# EAGLE design PCB (EAGLE 7.7.0)
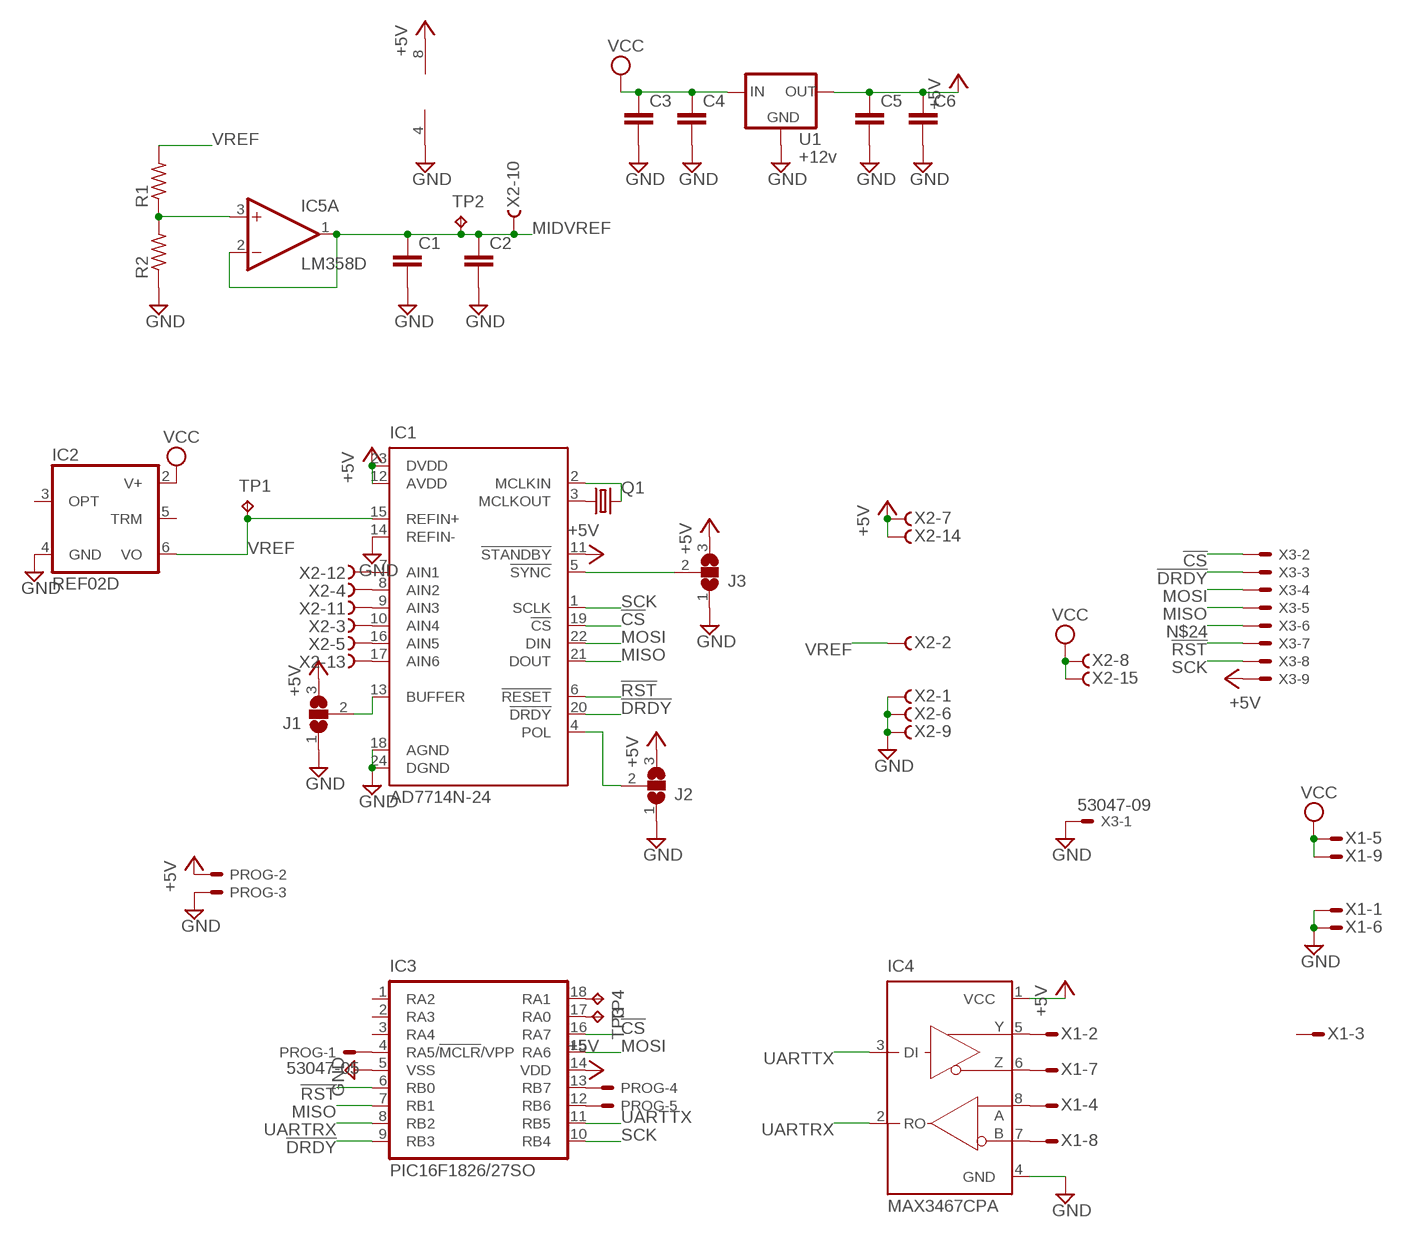
[diagram p0: schematic, sheet 1]

## Parts
C1  C-EUC1206K  [C1206K]
C2  C-EUC1206K  [C1206K]
C3  C-EUC1206K  [C1206K]
C4  C-EUC1206K  [C1206K]
C5  C-EUC1206K  [C1206K]
C6  C-EUC1206K  [C1206K]
IC1  AD7714N-24  [DIL24-3]
IC2  REF02D  [SO08]
IC3  PIC16F1826/27SO  [SO-18W]
IC4  MAX3467CPA  [SO08]
IC5  LM358D  [SO08]
J1  SJ2W  [SJ_2]
J2  SJ2W  [SJ_2]
J3  SJ2W  [SJ_2]
PROG  53047-05  [53047-05]
Q1  CRYSTALHC49S  [HC49/S]
R1  R-US_M1206  [M1206]
R2  R-US_M1206  [M1206]
TP1  TPB1,27  [B1,27]
TP2  TPB1,27  [B1,27]
TP3  TPB1,27  [B1,27]
TP4  TPB1,27  [B1,27]
U1  +12v  V_REG_78XX7812  [TO-252]
X1  M09HPS  [M09HP]
X2  F15HPS  [F15HP]
X3  53047-09  [53047-09]

## Nets
!CS: IC1.19(!CS) IC3.16(RA7) X3.2
!DRDY: IC1.20(!DRDY) IC3.9(RB3) X3.3
!RST: IC1.6(!RESET) IC3.6(RB0) X3.7
+5V: C5.1 C6.1 IC1.11(!STANDBY) IC1.12(AVDD) IC1.23(DVDD) IC3.14(VDD) IC4.1(VCC) IC5.8(P:V+) J1.3 J2.3 J3.3 PROG.2 U1.2(OUT) X2.7 X2.14 X3.9
GND: C1.2 C2.2 C3.2 C4.2 C5.2 C6.2 IC1.14(REFIN-) IC1.18(AGND) IC1.24(DGND) IC2.4(GND) IC3.5(VSS) IC4.4(GND) IC5.4(P:V-) J1.1 J2.1 J3.1 PROG.3 R2.1 U1.3(GND) X1.1 X1.6 X2.1 X2.6 X2.9 X3.1
MIDVREF: C1.1 C2.1 IC5.1(A:OUT) IC5.2(A:-IN) TP2.TP X2.10
MISO: IC1.21(DOUT) IC3.7(RB1) X3.5
MOSI: IC1.22(DIN) IC3.15(RA6) X3.4
N$1: IC1.3(MCLKOUT) Q1.1
N$2: IC1.2(MCLKIN) Q1.2
N$3: IC1.13(BUFFER) J1.2
N$4: IC1.4(POL) J2.2
N$5: IC4.5(Y) X1.2
N$6: IC4.6(Z) X1.7
N$7: IC4.8(A) X1.4
N$8: IC4.7(B) X1.8
N$9: IC5.3(A:+IN) R1.1 R2.2
N$10: IC1.10(AIN4) X2.3
N$11: IC1.9(AIN3) X2.11
N$12: IC1.8(AIN2) X2.4
N$13: IC1.7(AIN1) X2.12
N$14: IC1.5(!SYNC) J3.2
N$15: IC1.16(AIN5) X2.5
N$16: IC1.17(AIN6) X2.13
N$17: IC3.4(RA5/!MCLR!/VPP) PROG.1
N$18: IC3.13(RB7) PROG.4
N$19: IC3.12(RB6) PROG.5
N$20: IC3.17(RA0) TP3.TP
N$21: IC3.18(RA1) TP4.TP
N$24: X3.6
SCK: IC1.1(SCLK) IC3.10(RB4) X3.8
UARTRX: IC3.8(RB2) IC4.2(RO)
UARTTX: IC3.11(RB5) IC4.3(DI)
VCC: C3.1 C4.1 IC2.2(V+) U1.1(IN) X1.5 X1.9 X2.8 X2.15
VREF: IC1.15(REFIN+) IC2.6(VO) R1.2 TP1.TP X2.2
Unconnected: IC2.3(OPT) IC2.5(TRM) IC3.1(RA2) IC3.2(RA3) IC3.3(RA4) IC5.5(B:+IN) IC5.6(B:-IN) IC5.7(B:OUT) X1.3

## Library data of the parts
C1-C6 = resistor:C-EU: CAPACITOR, European symbol
IC1 = analog-devices:AD7714: Signal Conditioning ADC 3 V/5 V, CMOS, 500 mA Source: http://www.analog.com/UploadedFiles/Data_Sheets/39677768AD7714_c.pdf; MF: ALTERA CORPORATION; MPN: AD7714AN-5; OC_FARNELL: unknown; OC_NEWARK: 66F5871
IC2 = linear:REF02: VOLTAGE REFERENCE
IC3 = microchip:PIC16*F1826/27: 18/20/28-Pin Flash Microcontrollers with nanoWatt XLP Technology Source: www.microchip.com PIC16F1827.pdf
IC4 = maxim:MAX3467*: +5V, Fail-Safe, 40Mbps, Profibus RS-485/RS-422 Transceivers Source: MAX3465-MAX3469.pdf; OC_FARNELL: unknown; OC_NEWARK: unknown
IC5 = linear:LM358: OP AMP also LM158; LM258; LM2904 Source: http://cache.national.com/ds/LM/LM158.pdf
J1-J3 = jumper:SJ2W: SMD solder JUMPER
PROG = con-molex:53?-05: CONNECTOR wire to board 1.25 mm (.049 inch) pitch header; MF: MOLEX; MPN: 53047-0510; OC_FARNELL: 9732861; OC_NEWARK: 38C9901
Q1 = crystal:CRYSTAL: CRYSTAL; OC_FARNELL: 1667008; OC_NEWARK: unknown
R1 R2 = resistor:R-US_: RESISTOR, American symbol
TP1-TP4 = testpad:TP: Test pad
U1 = SparkFun-IC-Power:V_REG_78XX: Voltage Regulator Standard 78xx regulator. IGO (Input Ground Output). Spark Fun Electronics SKU : COM-00107; PROD_ID: VREG-12370
X1 = con-subd:M09?S: SUB-D; OC_FARNELL: unknown; OC_NEWARK: unknown
X2 = con-subd:F15?S: SUB-D; OC_FARNELL: unknown; OC_NEWARK: unknown
X3 = con-molex:53?-09: CONNECTOR wire to board 1.25 mm (.049 inch) pitch header; MPN: 53047-0910; OC_FARNELL: 9732888; OC_NEWARK: 98K9827

## Board
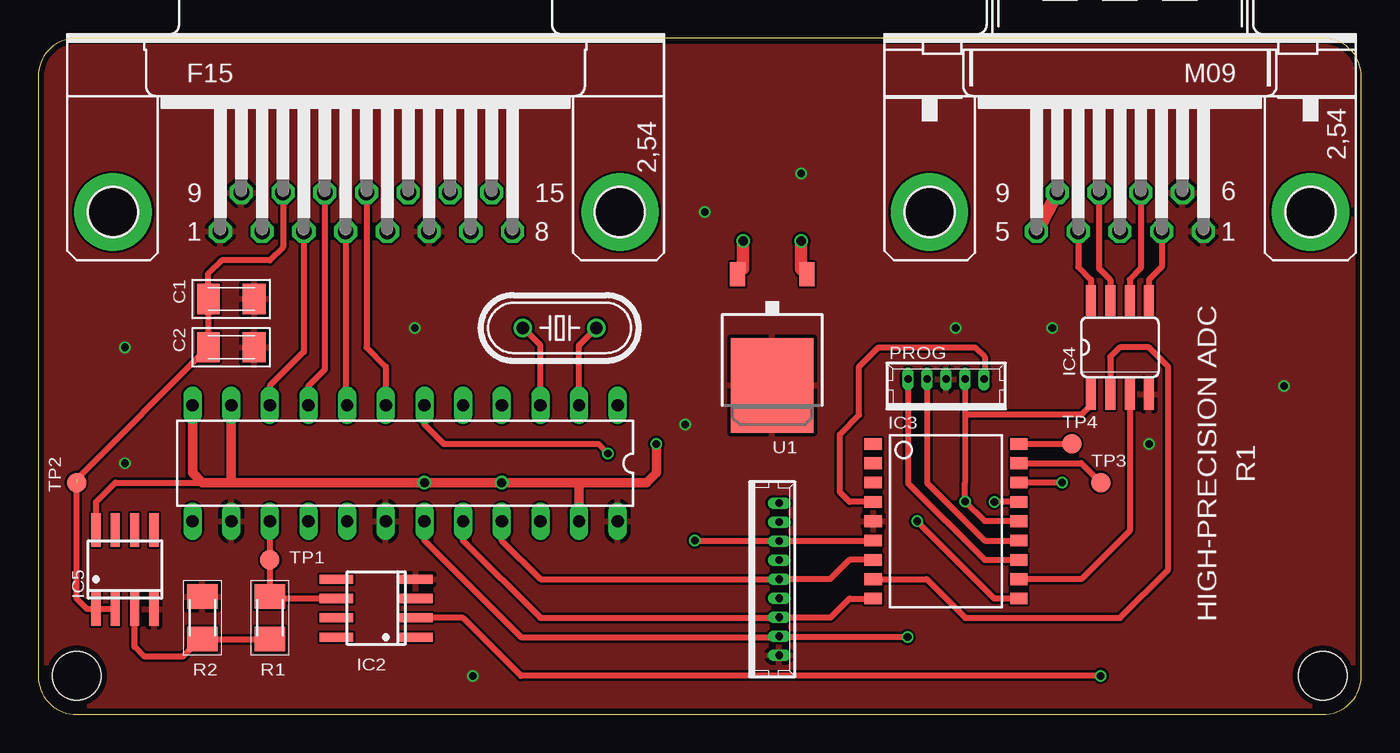
[diagram p1: board, top side]
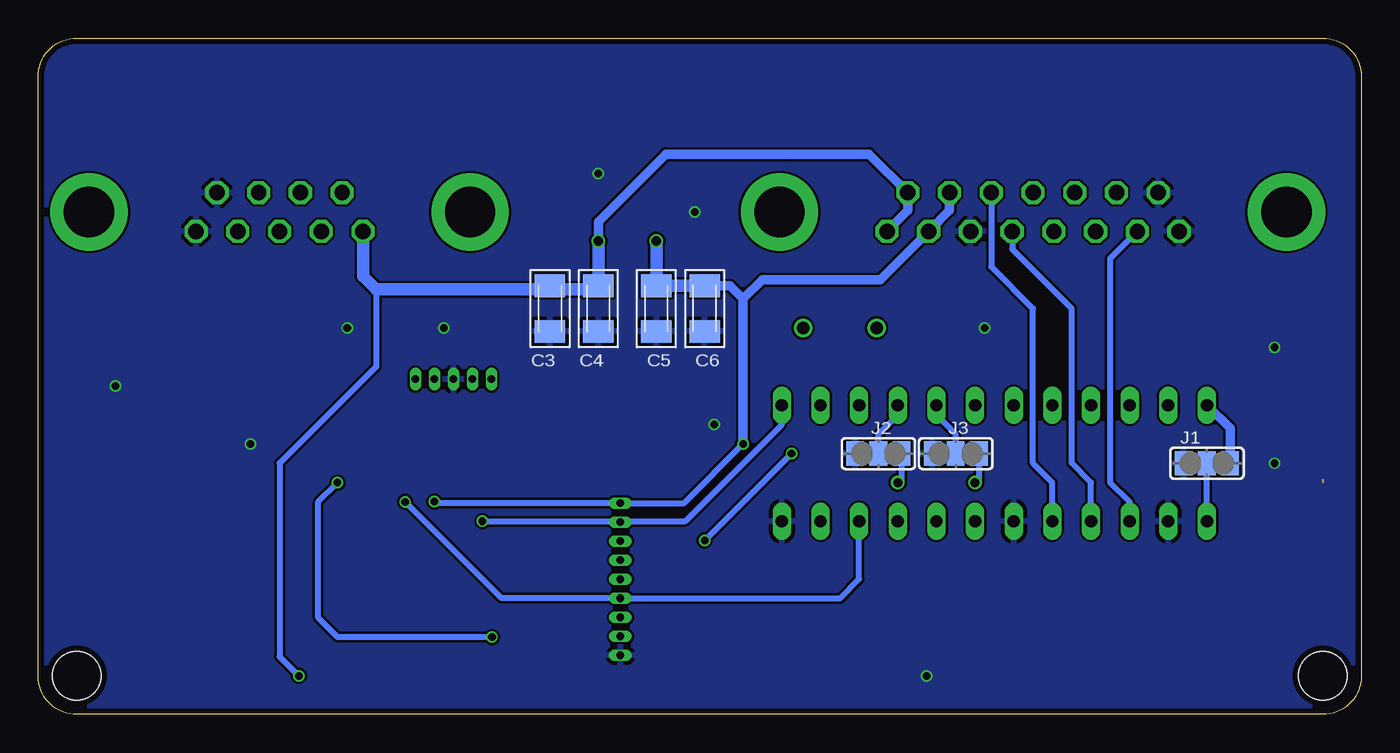
[diagram p2: board, bottom side, seen from below]

Size 87 x 44.45 mm. Coordinates in mm from the lower left corner, seen from the top.
Outline: 84.45,44.45 2.54,44.45 arc90 0,41.91 0,2.54 arc90 2.54,0 84.45,0 arc90 87,2.54 87,41.91 arc90 84.45,44.45
Copper layers (1*16): Top 0.035559375mm / dielectric 1.6mm / Bottom 0.035559375mm
Design rules "oshpark-2layer": minimum track width 6mil, minimum drill 10mil, track to track 6mil, track to pad 6mil, pad to pad 6mil, via to via 6mil, smd to smd 6mil, copper to edge 15mil, drill to drill 6mil, minimum pad ring 5mil, minimum via ring 5mil, stop-mask expansion 2.5mil, vias tented up to drill 0mil, thermal gap 10mil
Holes 3.2 mm at 2.54,2.54 84.45,2.54

### Footprints (pad centres in the part's own frame; a part is rotated, then mirrored left to right if it is on the bottom)
C1206K = smd 1.5 x 2: 1 -1.5,0; 2 1.5,0
DIL24-3 = drill 0.813 long: 1 -13.97,-3.81; 2 -11.43,-3.81; 3 -8.89,-3.81; 4 -6.35,-3.81; 5 -3.81,-3.81; 6 -1.27,-3.81; 7 1.27,-3.81; 8 3.81,-3.81; 9 6.35,-3.81; 10 8.89,-3.81; 11 11.43,-3.81; 12 13.97,-3.81; 13 13.97,3.81; 14 11.43,3.81; 15 8.89,3.81; 16 6.35,3.81; 17 3.81,3.81; 18 1.27,3.81; 19 -1.27,3.81; 20 -3.81,3.81; 21 -6.35,3.81; 22 -8.89,3.81; 23 -11.43,3.81; 24 -13.97,3.81
SO08 = smd 0.6 x 2.2: 1 -1.905,-2.6; 2 -0.635,-2.6; 3 0.635,-2.6; 4 1.905,-2.6; 5 1.905,2.6; 6 0.635,2.6; 7 -0.635,2.6; 8 -1.905,2.6
SO-18W = smd 0.762 x 1.143: 1 -5.08,-4.788; 2 -3.81,-4.788; 3 -2.54,-4.788; 4 -1.27,-4.788; 5 0,-4.788; 6 1.27,-4.788; 7 2.54,-4.788; 8 3.81,-4.788; 9 5.08,-4.788; 10 5.08,4.788; 11 3.81,4.788; 12 2.54,4.788; 13 1.27,4.788; 14 0,4.788; 15 -1.27,4.788; 16 -2.54,4.788; 17 -3.81,4.788; 18 -5.08,4.788
SO08' = smd 0.66 x 2.032: 1 -1.905,-3.073; 2 -0.635,-3.073; 3 0.635,-3.073; 4 1.905,-3.073; 5 1.905,3.073; 6 0.635,3.073; 7 -0.635,3.073; 8 -1.905,3.073
SJ_2 = smd 1.168 x 1.6: 1 -1.524,0; 2 0,0; 3 1.524,0
53047-05 = drill 0.5 pad 0.698 long: 1 2.5,0.45; 2 1.25,0.45; 3 0,0.45; 4 -1.25,0.45; 5 -2.5,0.45
HC49/S = drill 0.813: 1 -2.413,0; 2 2.413,0
M1206 = smd 1.6 x 2: 1 -1.4,0; 2 1.4,0
B1,27 = smd 1.27 x 1.27: TP 0,0
TO-252 = smd 1 x 1.6: 1 -2.28,-4.8; 2 2.28,-4.8 | smd 5.4 x 6.2: 3 0,2.5
M09HP = drill 1.016 octagon: 1 -5.486,1.27; 2 -2.743,1.27; 3 0,1.27; 4 2.743,1.27; 5 5.486,1.27; 6 -4.115,-1.27; 7 -1.372,-1.27; 8 1.372,-1.27; 9 4.115,-1.27 | drill 3.302 pad 5.08: G1 -12.522,0; G2 12.522,0
F15HP = drill 1.016 octagon: 1 -9.601,-1.27; 2 -6.858,-1.27; 3 -4.115,-1.27; 4 -1.372,-1.27; 5 1.372,-1.27; 6 4.115,-1.27; 7 6.858,-1.27; 8 9.601,-1.27; 9 -8.23,1.27; 10 -5.486,1.27; 11 -2.743,1.27; 12 0,1.27; 13 2.743,1.27; 14 5.486,1.27; 15 8.23,1.27 | drill 3.302 pad 5.08: G1 -16.662,0; G2 16.662,0
53047-09 = drill 0.5 pad 0.698 long: 1 5,0.45; 2 3.75,0.45; 3 2.5,0.45; 4 1.25,0.45; 5 0,0.45; 6 -1.25,0.45; 7 -2.5,0.45; 8 -3.75,0.45; 9 -5,0.45

### Placement (x,y rotation side)
C1  12.7,27.3 0 top
C2  12.7,24.13 0 top
C3  53.34,26.67 270 bottom
C4  50.16,26.67 270 bottom
C5  46.35,26.67 270 bottom
C6  43.18,26.67 270 bottom
IC1  24.13,16.51 180 top
IC2  22.23,6.99 90 top
IC3  59.69,12.7 270 top
IC4  MAX3467CPA  [SO08']  71.12,24.13 0 top
IC5  5.71,9.53 0 top
J1  10.16,16.51 0 bottom
J2  31.75,17.14 0 bottom
J3  26.67,17.14 0 bottom
PROG  59.69,21.59 0 top
Q1  34.29,25.4 0 top
R1  15.24,6.35 90 top
R2  10.79,6.35 270 top
TP1  15.24,10.16 0 top
TP2  2.54,15.24 90 top
TP3  69.85,15.24 0 top
TP4  67.94,17.78 0 top
U1  48.26,24.13 180 top
X1  71.12,33.02 180 top
X2  21.59,33.02 0 top
X3  48.26,8.89 270 top

### Tracks (layer width: path | path; a pad name or v marks a point on that pad's centre or on a via)
!CS  (via drill 0.5)
  Top 0.406: IC1.19 25.4,11.43 31.75,5.08 48.65,5.08 X3.2 48.77,5.08 v57.15,5.08 | v67.31,15.24 IC3.16
  Bottom 0.406: v57.15,5.08 67.31,5.08 68.58,6.35 68.58,13.97 v67.31,15.24
!DRDY
  Top 0.406: IC1.20 27.94,11.43 33.02,6.35 48.67,6.35 X3.3 52.11,6.39 53.34,7.62 IC3.9
!RST  (via drill 0.5)
  Top 0.406: IC1.6 25.4,19.05 26.67,17.78 36.83,17.78 v37.47,17.14 | v43.18,11.43 48.26,11.43 | 48.26,11.43 IC3.6 | X3.7 48.3,11.39 48.26,11.43
  Bottom 0.406: v37.47,17.14 v43.18,11.43
+5V  (via drill 0.5, 0.6)
  Top 0.406: IC5.8 3.81,13.97 5.08,15.24 11.43,15.24 | IC3.14 62.23,12.7 v60.94,13.99 60.94,15.24 60.94,19.68 | PROG.2 60.94,19.68 | IC4.1 69.22,20.32 68.58,19.68 60.94,19.68
  Top 0.61: 35.56,15.24 40.01,15.24 40.64,15.88 v40.64,17.78 | 35.56,15.24 v30.48,15.24 v25.4,15.24 12.7,15.24 | 12.7,15.24 11.43,15.24 10.79,15.24 10.16,15.88 IC1.12 | IC1.11 12.7,15.24 | IC1.23 35.56,15.24
  Top 0.813: v46.35,31.11 46.35,29.3 U1.2
  Bottom 0.406: J2.3 30.23,15.49 v30.48,15.24 | J3.3 25.15,15.49 v25.4,15.24 | v40.64,17.78 44.53,13.89 X3.9 60.84,13.89 v60.94,13.99
  Bottom 0.61: C6.1 41.51,28.17 40.64,27.3 | J1.3 8.64,18.8 IC1.12 | 40.64,27.3 v40.64,17.78 | X2.14 27.08,33.12 X2.7 31.62,28.57 39.37,28.57 40.64,27.3
  Bottom 0.813: C6.1 C5.1 v46.35,31.11
GND  (via drill 0.5)
  other vias: 73.03,17.78 81.92,21.59 66.67,25.4 60.33,25.4 50.16,35.56 43.81,33.02 42.55,19.05 28.57,2.54 24.77,25.4 5.71,24.13 5.71,16.51
  pour Bottom: -15.24,46.99 100.33,46.99 100.33,-1.27 -15.24,-1.27
  pour Top: -7.62,50.8 93.98,50.8 93.98,-5.08 -7.62,-5.08
MIDVREF  (1 unrouted)
  Top 0.406: IC5.2 IC5.1 3.23,6.92 2.54,7.62 2.54,15.47 C2.1 C1.1 11.2,28.98 12.06,29.84 15.24,29.84 16.1,30.71 X2.10
MISO
  Top 0.406: IC1.21 30.48,11.43 33.02,8.89 X3.5 52.07,8.89 53.34,10.16 IC3.7
MOSI  (via drill 0.5)
  Top 0.406: IC3.15 v62.87,13.97
  Bottom 0.406: v62.87,13.97 56.53,7.64 X3.4 48.69,7.62 34.29,7.62 33.02,8.89 IC1.22
N$1
  Top 0.406: IC1.3 33.02,24.26 Q1.1
N$2
  Top 0.406: IC1.2 35.56,24.26 Q1.2
N$3
  Bottom 0.406: IC1.13 J1.2
N$4
  Bottom 0.406: J2.2 31.75,18.41 30.48,19.68 IC1.4
N$5
  Top 0.406: X1.2 73.86,29.41 73.03,28.57 IC4.5
N$6
  Top 0.406: X1.7 72.49,29.31 71.75,28.57 IC4.6
N$7
  Top 0.406: X1.4 68.38,29.41 69.22,28.57 IC4.8
N$8
  Top 0.406: X1.8 69.75,29.31 70.48,28.57 IC4.7
N$9
  Top 0.406: R1.1 R2.2 10.66,4.95 9.53,3.81 6.99,3.81 6.35,4.45 IC5.3
N$10
  Top 0.406: X2.3 17.48,23.82 15.24,21.59 IC1.10
N$11
  Top 0.406: X2.11 18.85,22.66 17.78,21.59 IC1.9
N$12
  Top 0.406: X2.4 20.22,20.42 IC1.8
N$13
  Top 0.406: X2.12 21.59,24.13 22.86,22.86 IC1.7
N$14
  Bottom 0.406: J3.2 26.67,18.41 27.94,19.68 IC1.5
N$15
  Bottom 0.406: IC1.16 17.78,15.24 19.05,16.51 19.05,26.67 22.96,30.58 X2.5
N$16
  Bottom 0.406: IC1.17 20.32,15.24 21.59,16.51 21.59,26.67 24.33,29.41 X2.13
N$17
  Top 0.406: IC3.4 53.34,13.97 52.7,14.61 52.7,18.41 53.98,19.68 53.98,22.86 55.24,24.13 61.59,24.13 62.23,23.5 62.23,22.08 PROG.1
N$18
  Top 0.406: PROG.4 58.44,15.22 62.23,11.43 IC3.13
N$19
  Top 0.406: PROG.5 57.19,15.2 62.23,10.16 IC3.12
N$20
  Top 0.406: IC3.17 68.58,16.51 TP3.TP
N$21
  Top 0.406: IC3.18 TP4.TP
SCK  (via drill 0.5)
  Top 0.406: IC3.10 62.87,7.62 v57.78,12.7
  Bottom 0.406: v57.78,12.7 48.26,12.7 | 48.26,12.7 44.45,12.7 38.1,19.05 IC1.1 | X3.8 48.32,12.64 48.26,12.7
UARTRX
  Top 0.406: IC3.8 58.42,8.89 60.96,6.35 71.12,6.35 74.3,9.53 74.3,22.86 73.03,24.13 71.12,24.13 70.48,23.5 IC4.2
UARTTX
  Top 0.406: IC4.3 71.75,12.06 68.58,8.89 IC3.11
VCC  (via drill 0.5, 0.6)
  Top 0.406: v69.85,2.54 31.75,2.54 27.94,6.35 IC2.2
  Top 0.813: X1.5 65.63,31.65 X1.9 | v50.16,31.11 50.16,29.3 U1.1
  Bottom 0.406: 64.77,27.94 64.77,22.86 71.12,16.51 71.12,3.81 v69.85,2.54
  Bottom 0.61: X2.8 29.82,33.12 X2.15 32.36,36.83 45.72,36.83 50.16,32.38 v50.16,31.11
  Bottom 0.813: X1.5 65.63,28.8 64.77,27.94 53.34,27.94 | 53.34,27.94 50.4,27.94 C4.1 v50.16,31.11 | C3.1 53.34,27.94
VREF
  Top 0.406: IC2.6 15.37,7.62 R1.2 TP1.TP IC1.15
  Bottom 0.406: IC1.15 15.24,13.97 16.51,15.24 16.51,29.97 X2.2

### Text on the board
tPlace: HIGH-PRECISION ADC | R1